# EAGLE design interface_dac_sma_feedback_2PS (EAGLE 7.2.0)
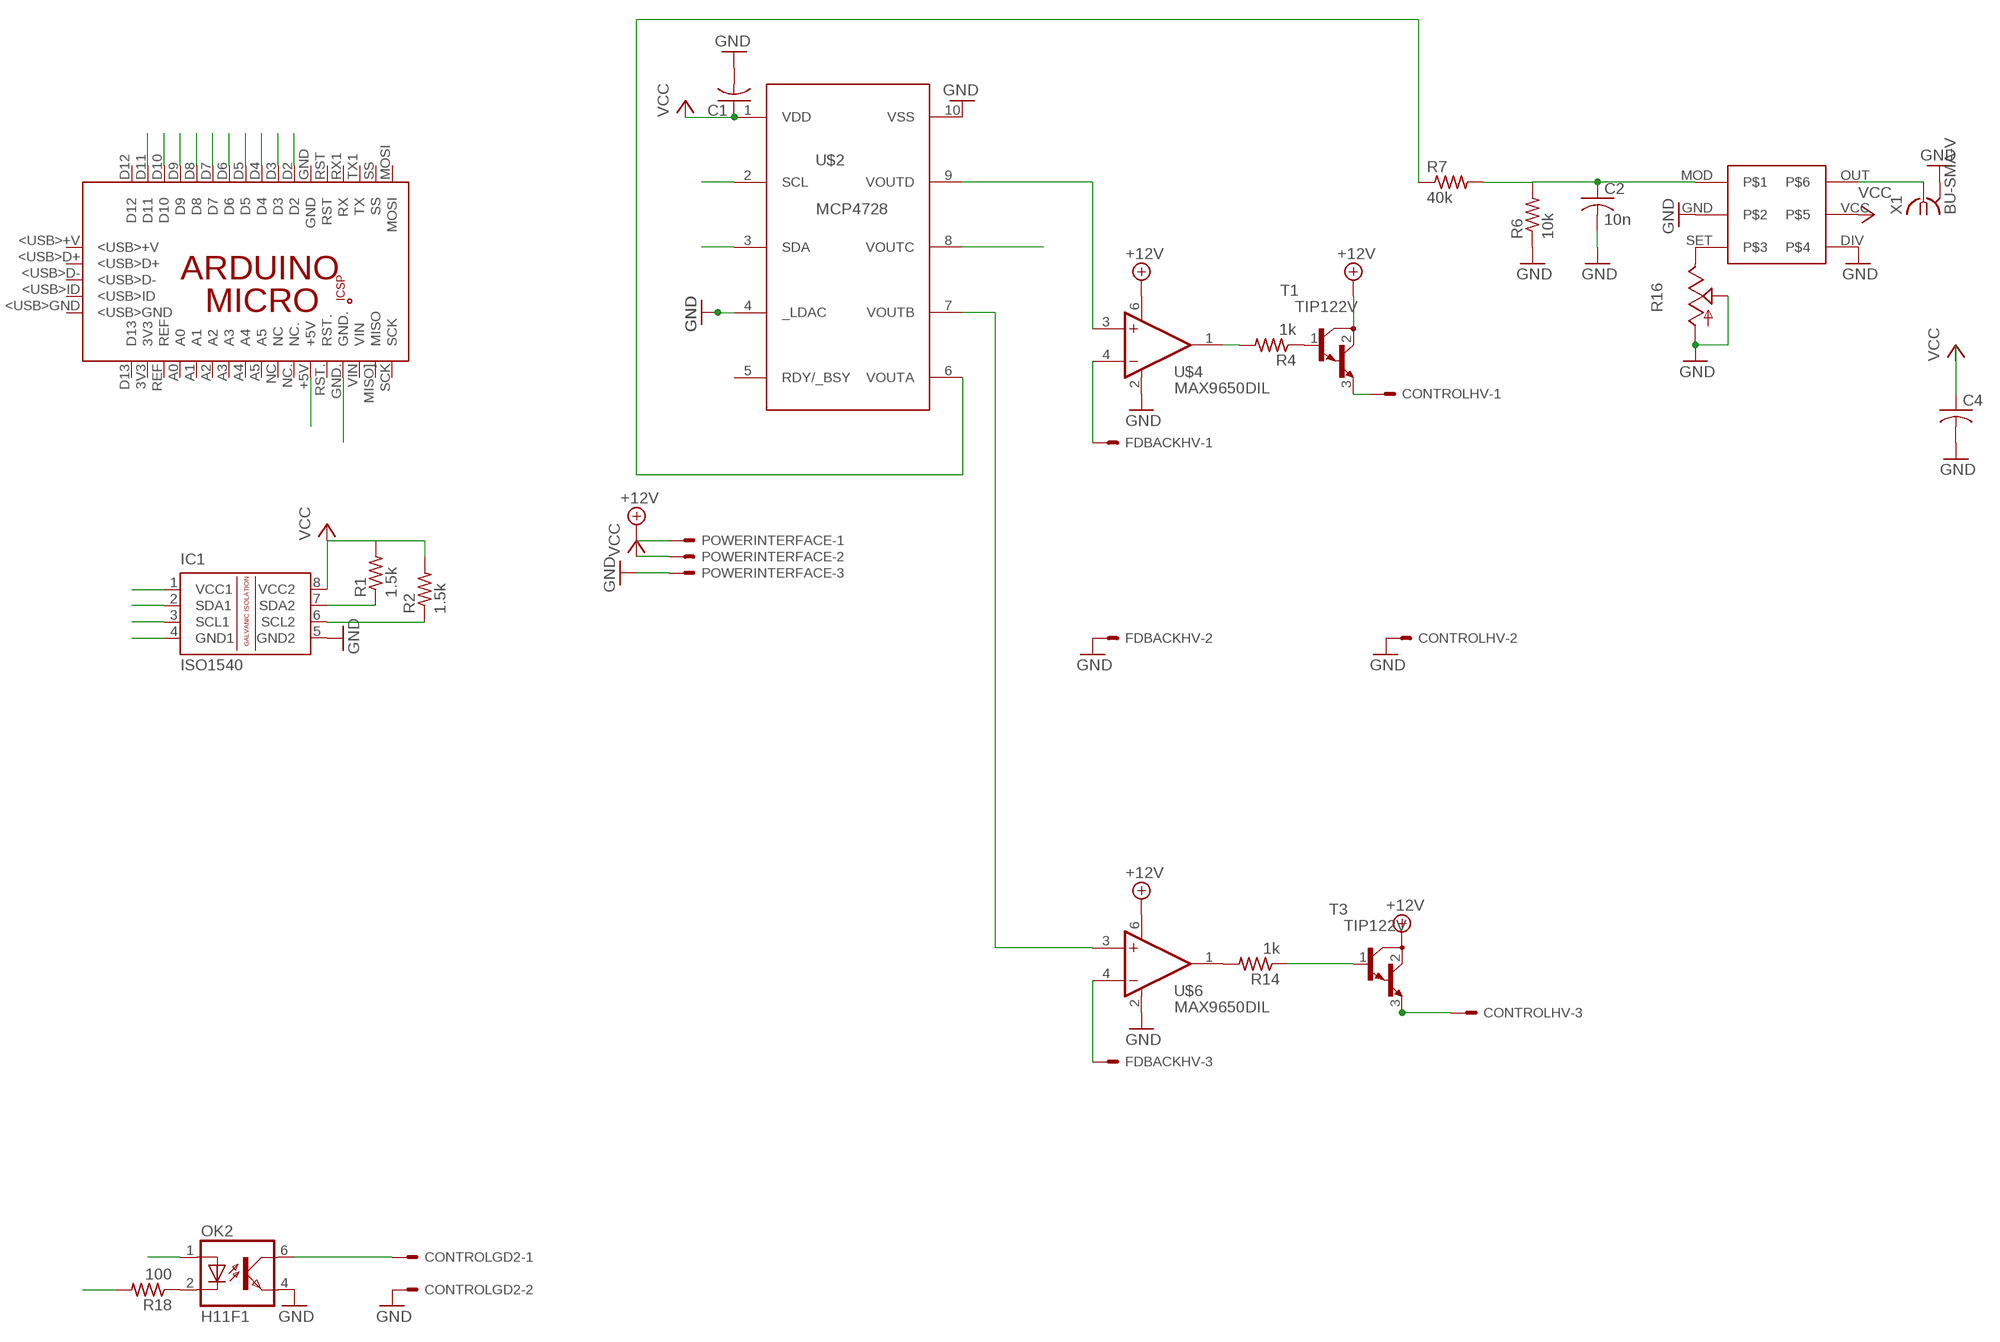
[diagram p0: schematic, sheet 1]

## Parts
C1  C-US050-050X075  [C050-050X075]
C2  10n  C-US050-024X044  [C050-024X044]
C4  C-US075-063X106  [C075-063X106]
CONTROLGD2  KK-156-2  [KK-156-2]
CONTROLHV  KK-156-3  [KK-156-3]
FDBACKHV  KK-156-3  [KK-156-3]
IC1  ISO1540  [DIL08]
OK2  H11F1  [DIL05]
PCB1  ARDUINO_MICRO  [ARDUINO_MICRO]
POWERINTERFACE  KK-156-3  [KK-156-3]
R1  1.5k  R-US_0207/12  [0207/12]
R2  1.5k  R-US_0207/12  [0207/12]
R4  1k  R-US_0207/12  [0207/12]
R6  10k  R-US_0207/12  [0207/12]
R7  40k  R-US_0207/12  [0207/12]
R14  1k  R-US_0207/12  [0207/12]
R16  TRIM_US-B90P  [SP19L]
R18  100  R-US_0207/12  [0207/12]
T1  TIP122V  [TO220V]
T3  TIP122V  [TO220V]
U$1  LTC6992  [DIL06]
U$2  MCP4728DIL  [DIL10]
U$4  MAX9650DIL  [DIL06-4]
U$6  MAX9650DIL  [DIL06-4]
X1  BU-SMA-V  [BU-SMA-V]

## Nets
+12V: POWERINTERFACE.1 T1.2(C) T3.2(C) U$4.6(V+) U$6.6(V+)
A+5: IC1.1(VCC1) PCB1.+5V
AGND: IC1.4(GND1) PCB1.GND. R18.2
D4: PCB1.D4
D7: PCB1.D7
D8: PCB1.D8
D10: PCB1.D10
D11: PCB1.D11
ENSW2: CONTROLGD2.1 OK2.6(COL)
GND: C1.2 C2.2 C4.2 CONTROLGD2.2 CONTROLHV.2 FDBACKHV.2 IC1.5(GND2) OK2.4(EMIT) POWERINTERFACE.3 R6.1 R16.A R16.S U$1.DIV U$1.GND U$2.4(_LDAC) U$2.10(VSS) U$4.2(V-) U$6.2(V-) X1.2 X1.3 X1.4 X1.5
N$1: R7.1 U$2.6(VOUTA)
N$2: C2.1 R6.2 R7.2 U$1.MOD
N$3: R4.1 T1.1(B)
N$4: CONTROLHV.1 T1.3(E)
N$5: CONTROLHV.3 T3.3(E)
N$6: OK2.2(C) R18.1
N$8: FDBACKHV.1 U$4.4(-IN)
N$12: R16.E U$1.SET
N$13: U$1.OUT X1.1
N$14: FDBACKHV.3 U$6.4(-IN)
N$15: R14.1 T3.1(B)
N$16: U$2.9(VOUTD) U$4.3(+IN)
N$17: U$2.8(VOUTC)
N$18: U$2.7(VOUTB) U$6.3(+IN)
N$19: R4.2 U$4.1(OUT)
N$21: R14.2 U$6.1(OUT)
PWM5: PCB1.D5
PWM6: PCB1.D6
PWM9: OK2.1(A) PCB1.D9
SCL: IC1.3(SCL1) PCB1.D3
SCL_OUT: IC1.6(SCL2) R2.1 U$2.2(SCL)
SDA: IC1.2(SDA1) PCB1.D2
SDA_OUT: IC1.7(SDA2) R1.1 U$2.3(SDA)
VCC: C1.1 C4.1 IC1.8(VCC2) POWERINTERFACE.2 R1.2 R2.2 U$1.VCC U$2.1(VDD)
Unconnected: PCB1.3V3 PCB1.5V PCB1.<USB>+V PCB1.<USB>D+ PCB1.<USB>D- PCB1.<USB>GND PCB1.<USB>ID PCB1.A0 PCB1.A1 PCB1.A2 PCB1.A3 PCB1.A4 PCB1.A5 PCB1.D12 PCB1.D13 PCB1.GND PCB1.GND_ PCB1.MISO. PCB1.MISO](MISO) PCB1.MOSI PCB1.MOSI. PCB1.NC PCB1.NC. PCB1.REF PCB1.RESET.. PCB1.RST PCB1.RST. PCB1.RX1(RX) PCB1.SCK PCB1.SCK. PCB1.SS PCB1.TX1(TX) PCB1.VIN U$2.5(RDY/_BSY)

## Library data of the parts
C1 = rcl:C-US: CAPACITOR, American symbol
C2 C4 = resistor:C-US: CAPACITOR, American symbol
CONTROLGD2 = con-molex:KK-156-2: KK 156 HEADER Source: http://www.molex.com/pdm_docs/sd/026604100_sd.pdf; OC_FARNELL: unknown; OC_NEWARK: unknown
CONTROLHV FDBACKHV POWERINTERFACE = con-molex:KK-156-3: KK 156 HEADER Source: http://www.molex.com/pdm_docs/sd/026604100_sd.pdf; OC_FARNELL: unknown; OC_NEWARK: unknown
IC1 = texas:ISO1540: ISOLATED CAN TRANSCEIVER Source: http://focus.ti.com/lit/ds/symlink/iso1050.pdf
OK2 = optocoupler:H11F1: OPTO COUPLER OPTO COUPLER; OC_FARNELL: unknown; OC_NEWARK: unknown
PCB1 = E14_Arduino_published:ARDUINO_MICRO: Device for representing an Arduino Micro board with a footprint in an EAGLE design. Created by Dave Young for Element14. More EAGLE documentation at: http://www.element14.com/community/community/knode/cadsoft_eagle
R1 R2 R4 R6 R7 R14 = resistor:R-US_: RESISTOR, American symbol
R16 = pot:TRIM_US-: POTENTIOMETER
R18 = rcl:R-US_: RESISTOR, American symbol
T1 T3 = transistor-npn:TIP122*: NPN Darlington Transistor
U$1 = linear-technology:LTC6992
U$2 = microchip:MCP4728
U$4 U$6 = maxim:MAX9650
X1 = con-coax:BU-SMA-V: FEMALE SMA CONNECTOR Radiall distributor RS 112-3794; OC_FARNELL: unknown; OC_NEWARK: unknown

## Board
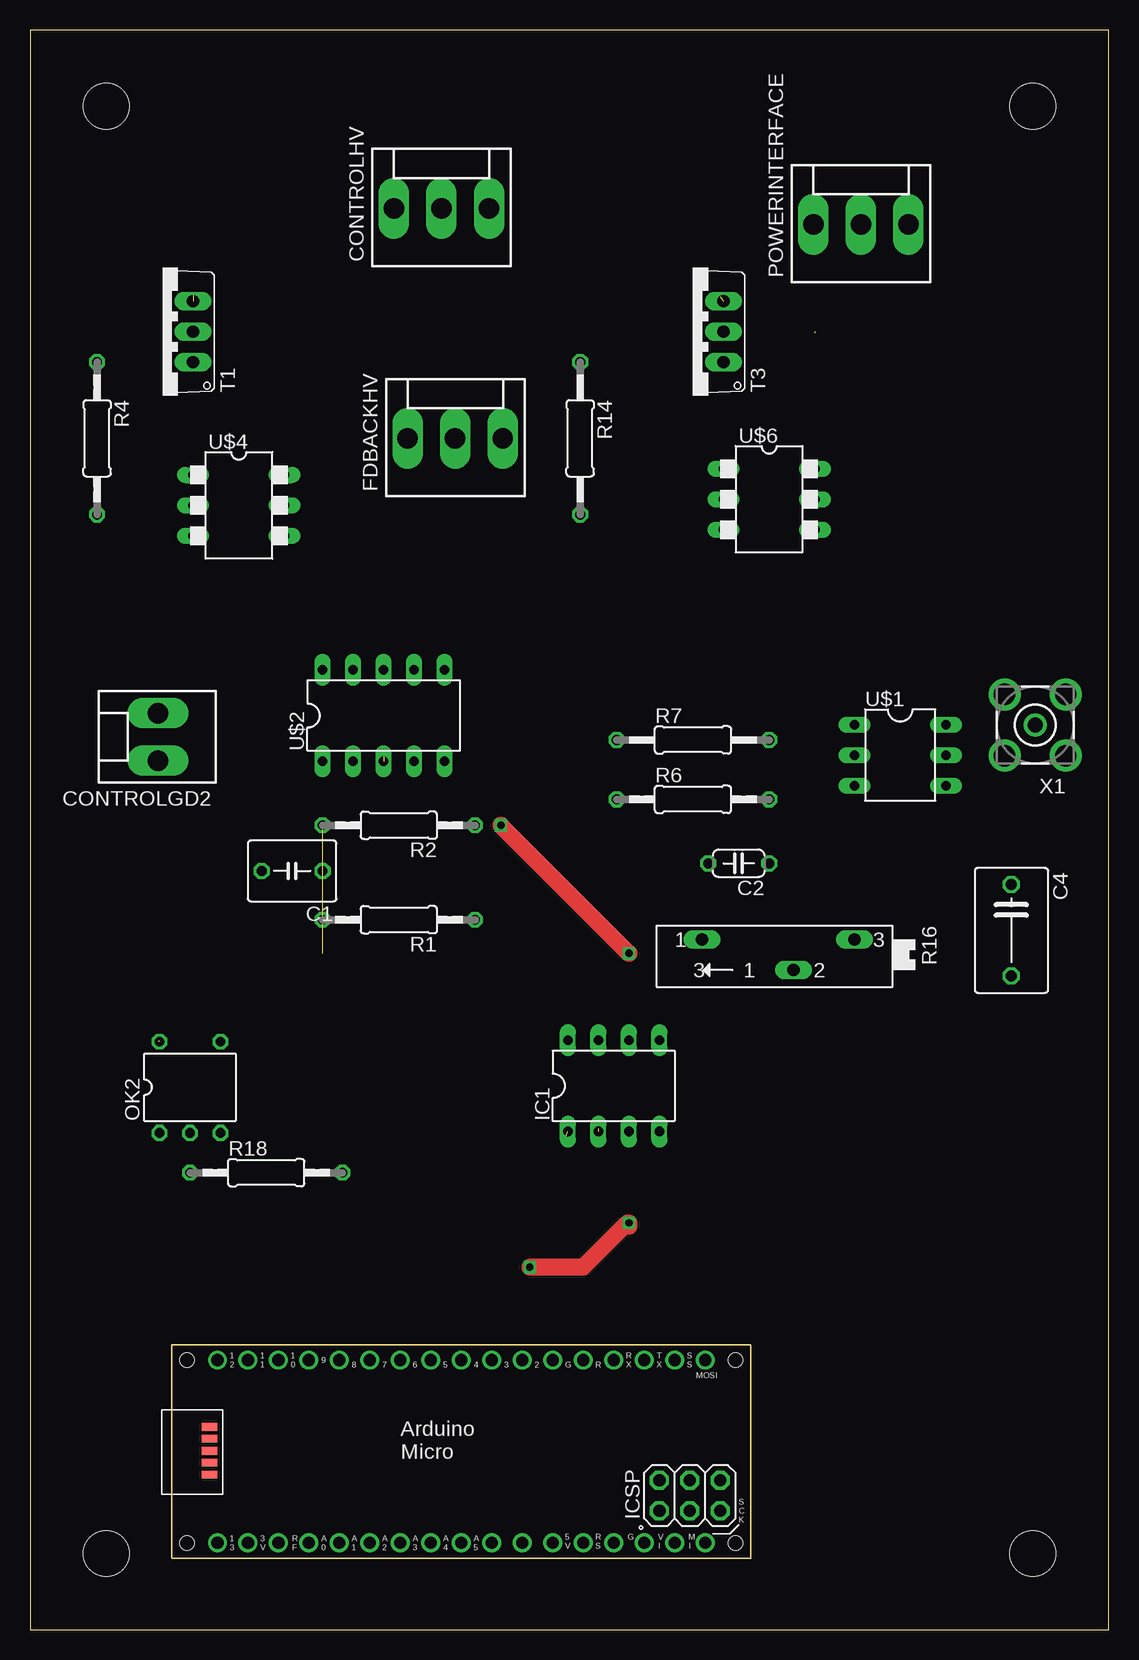
[diagram p1: board, top side]
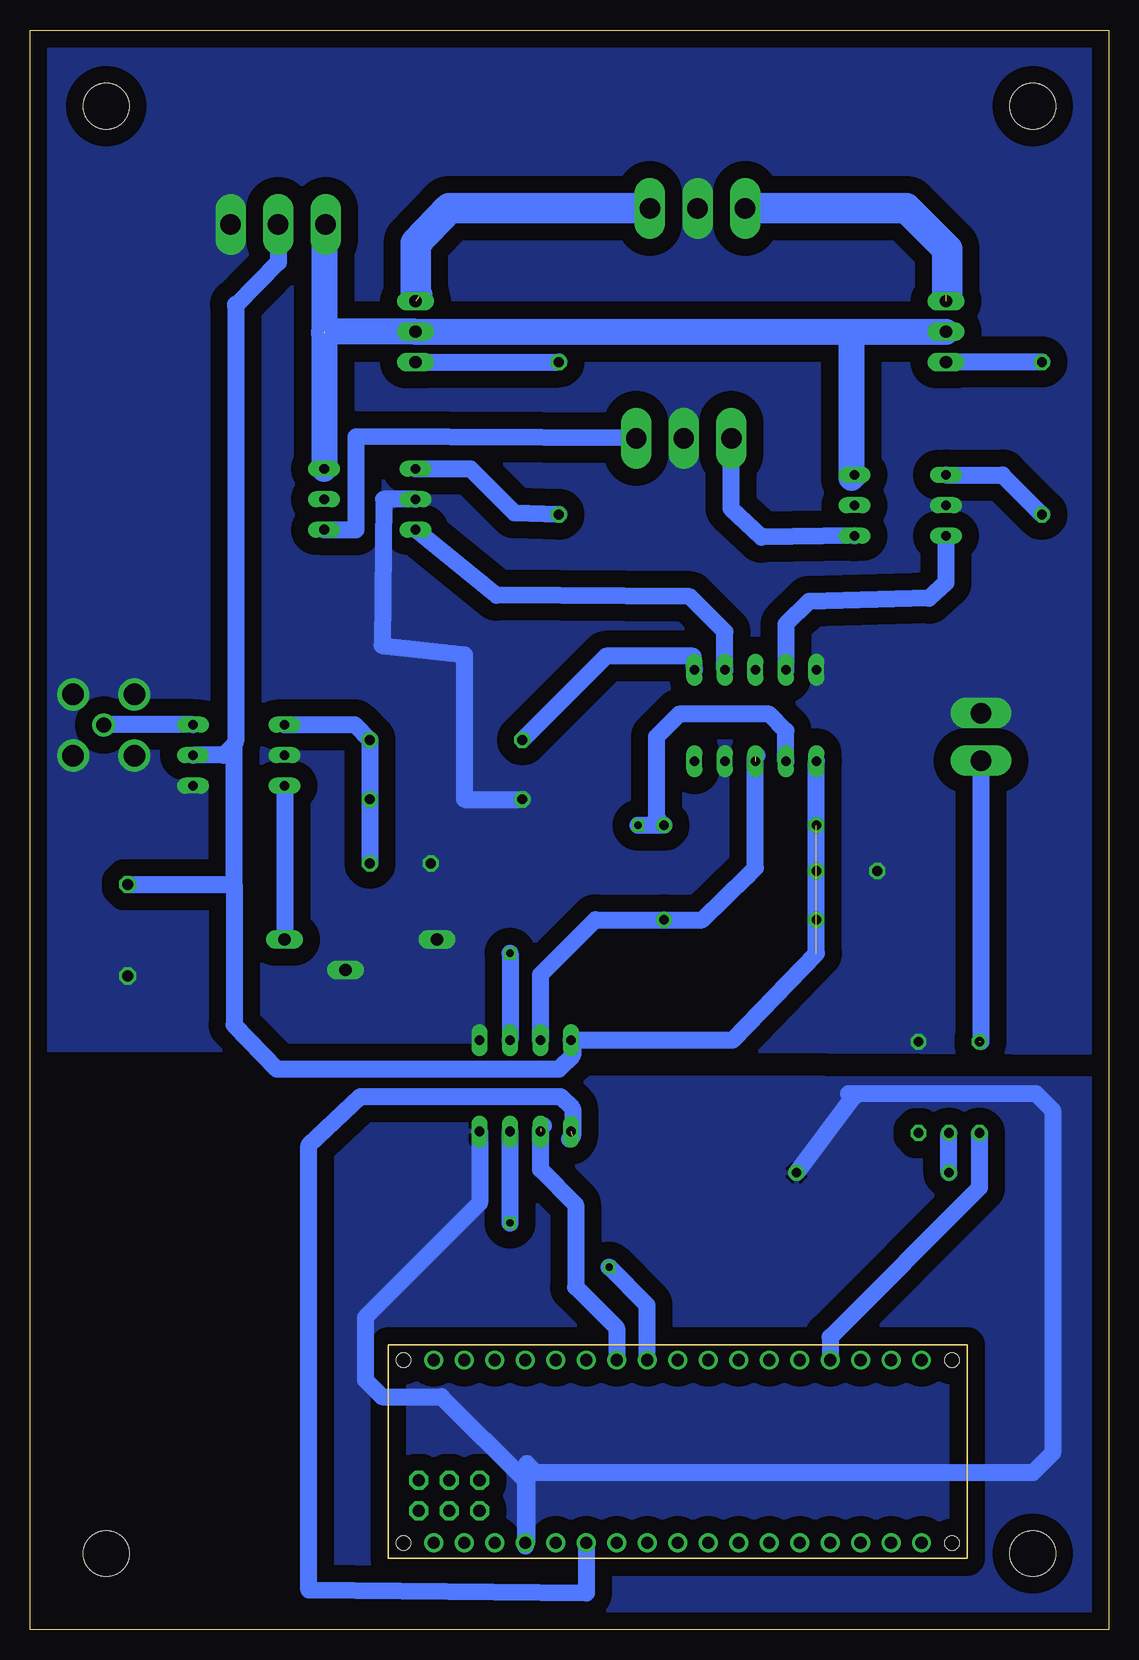
[diagram p2: board, bottom side, seen from below]

Size 89.92 x 133.35 mm. Coordinates in mm from the lower left corner, seen from the top.
Outline: 0,0 89.92,0 89.92,133.35 0,133.35 0,0
Copper layers (1*16): Top 0.035mm / dielectric 1.5mm / Bottom 0.035mm
Design rules "default": minimum track width 10mil, minimum drill 24mil, track to track 8mil, track to pad 8mil, pad to pad 8mil, via to via 8mil, smd to smd 8mil, copper to edge 40mil, drill to drill 8mil, minimum pad ring 10mil, minimum via ring 8mil, stop-mask expansion 4mil, vias tented up to drill 0mil, thermal gap 10mil
Holes 3.8 mm at 83.57,6.35 83.57,127 6.35,127 6.35,6.35

### Footprints (pad centres in the part's own frame; a part is rotated, then mirrored left to right if it is on the bottom)
C050-050X075 = drill 0.813 octagon: 1 -2.54,0; 2 2.54,0
C050-024X044 = drill 0.813 octagon: 1 -2.54,0; 2 2.54,0
C075-063X106 = drill 0.914 octagon: 1 -3.81,0; 2 3.81,0
KK-156-2 = drill 1.7 pad 2.184 long: 1 -1.98,0; 2 1.98,0
KK-156-3 = drill 1.7 pad 2.184 long: 1 -3.96,0; 2 0,0; 3 3.96,0
DIL08 = drill 0.813 long: 1 -3.81,-3.81; 2 -1.27,-3.81; 3 1.27,-3.81; 4 3.81,-3.81; 5 3.81,3.81; 6 1.27,3.81; 7 -1.27,3.81; 8 -3.81,3.81
DIL05 = drill 0.813 octagon: 1 -2.54,-3.81; 2 0,-3.81; 3 2.54,-3.81; 4 2.54,3.81; 6 -2.54,3.81
ARDUINO_MICRO = drill 1.016 pad 1.575: 3V3 6.35,1.27; +5V 31.75,1.27; A0 11.43,1.27; A1 13.97,1.27; A2 16.51,1.27; A3 19.05,1.27; A4 21.59,1.27; A5 24.13,1.27; D2 29.21,16.51; D3 26.67,16.51; D4 24.13,16.51; D5 21.59,16.51; D6 19.05,16.51; D7 16.51,16.51; D8 13.97,16.51; D9 11.43,16.51; D10 8.89,16.51; D11 6.35,16.51; D12 3.81,16.51; D13 3.81,1.27; GND 31.75,16.51; GND. 36.83,1.27; MISO] 41.91,1.27; MOSI 44.45,16.51; NC 26.67,1.27; NC. 29.21,1.27; REF 8.89,1.27; RST 34.29,16.51; RST. 34.29,1.27; RX1 36.83,16.51; SCK 44.45,1.27; SS 41.91,16.51; TX1 39.37,16.51; VIN 39.37,1.27 | drill 1.016 pad 1.575 octagon: 5V 40.64,6.477; GND_ 45.72,6.477; MISO. 40.64,3.937; MOSI. 43.18,6.477; RESET.. 45.72,3.937; SCK. 43.18,3.937 | smd 1.27 x 0.635: <USB>+V 3.15,10.947; <USB>D+ 3.15,9.957; <USB>D- 3.15,8.941; <USB>GND 3.15,6.96; <USB>ID 3.15,7.976 | hole 1.2: 1.27,1.27; 1.27,16.51; 46.99,16.51; 46.99,1.27
0207/12 = drill 0.813 octagon: 1 -6.35,0; 2 6.35,0
SP19L = drill 1.016 long: A 5.715,-1.27; E -6.985,-1.27; S -1.905,1.27
TO220V = drill 1.016 long: 1 -2.54,-2.54; 2 0,-2.54; 3 2.54,-2.54
DIL06 = drill 0.813 long: DIV 2.54,3.81; GND 0,-3.81; MOD -2.54,-3.81; OUT -2.54,3.81; SET 2.54,-3.81; VCC 0,3.81
DIL10 = drill 0.813 long: 1 -5.08,-3.81; 2 -2.54,-3.81; 3 0,-3.81; 4 2.54,-3.81; 5 5.08,-3.81; 6 5.08,3.81; 7 2.54,3.81; 8 0,3.81; 9 -2.54,3.81; 10 -5.08,3.81
DIL06-4 = drill 0.813 long: 1 -2.54,-3.81; 2 0,-3.81; 3 2.54,-3.81; 4 2.54,3.81; 5 0,3.81; 6 -2.54,3.81
BU-SMA-V = drill 1.27: 1 0,0 | drill 1.778: 2 -2.55,2.55; 3 2.55,2.55; 4 2.55,-2.55; 5 -2.55,-2.55

### Placement (x,y rotation side)
C1  21.84,63.25 180 top
C2  59.05,63.88 180 top
C4  81.79,58.29 270 top
CONTROLGD2  10.67,74.42 90 top
CONTROLHV  34.29,118.49 0 top
FDBACKHV  35.43,99.31 0 top
IC1  48.64,45.34 0 top
OK2  13.34,45.21 0 top
PCB1  11.81,5.97 0 top
POWERINTERFACE  69.24,117.14 0 top
R1  30.73,59.18 180 top
R2  30.73,67.06 180 top
R4  5.59,99.31 270 top
R6  55.24,69.22 0 top
R7  55.24,74.17 0 top
R14  45.85,99.31 270 top
R16  61.72,56.26 180 top
R18  19.68,38.1 0 top
T1  11.05,108.2 90 top
T3  55.24,108.2 90 top
U$1  72.52,72.9 270 top
U$2  29.46,76.2 0 top
U$4  17.4,93.73 270 top
U$6  61.59,94.23 270 top
X1  83.77,75.41 180 top

### Tracks (layer width: path | path; a pad name or v marks a point on that pad's centre or on a via)
+12V  (1 unrouted)
  Bottom 2.184: U$4.6 21.46,96.01 21.46,108.2 | 21.46,108.2 T3.2 65.41,108.2 | 21.46,108.2 T1.2 | POWERINTERFACE.1 65.41,117.02 65.41,108.08 U$6.6
A+5  (1 unrouted)
  Bottom 1.422: PCB1.+5V 43.56,3.05 66.67,3.3 66.67,40.39 62.36,44.45 45.72,44.45 44.7,43.43 44.7,41.15 44.96,40.89
AGND
  Bottom 1.422: IC1.4 52.45,35.56 61.98,26.04 61.98,20.83 60.58,19.43 55.63,19.43 48.64,12.45 PCB1.GND. | PCB1.GND. 48.64,6.99 | R18.2 21.34,44.32 21.72,44.7 6.1,44.7 4.7,43.31 4.7,14.73 6.35,13.08 47.75,13.08 48.51,13.84 48.51,7.37 PCB1.GND.
  pour Bottom (isolate 1.422): -0.13,0.13 94.23,0.13 94.36,46.1 0.13,45.97
ENSW2  (1 unrouted)
  Bottom 1.422: CONTROLGD2.1 10.67,49.02
GND
  Bottom 1.422: U$6.2 60.45,94.23 60.58,82.04 53.72,81.28 53.72,69.22 R6.1
  pour Bottom (isolate 1.422, no thermals): 0.13,133.22 90.04,133.22 89.92,48.39 69.34,48.39 69.6,48.51 0.38,48.13
N$1
  Bottom 1.422: U$2.6 34.67,81.15 41.91,81.15 R7.1
N$2
  Bottom 1.422: U$1.MOD 62.87,75.44 R7.2 R6.2 C2.1
N$3
  Bottom 1.422: R4.1 T1.1
N$4  (1 unrouted)
  Bottom 2.184: 13.46,111.38 13.59,111.25
  Bottom 2.54: CONTROLHV.1 16.89,118.49 13.46,115.06 13.46,111.38
N$5  (1 unrouted)
  Bottom 2.184: 57.66,111.25 57.53,111.12
  Bottom 2.54: CONTROLHV.3 54.99,118.49 57.78,115.57 57.78,111.38 57.66,111.25
N$6
  Bottom 1.422: R18.1 OK2.2
N$8
  Bottom 1.422: U$4.4 28.96,91.06 31.5,93.47 31.5,98.96 FDBACKHV.1
N$12
  Bottom 1.422: U$1.SET R16.E
N$13
  Bottom 1.422: U$1.OUT 83.49,75.44 X1.1
N$14
  Bottom 1.422: U$6.4 62.74,91.69 62.74,99.44 FDBACKHV.3
N$15
  Bottom 1.422: T3.1 R14.1
N$16
  Bottom 1.422: U$4.3 13.59,87.25 14.99,85.98 25.02,85.72 26.92,83.82 U$2.9
N$18
  Bottom 1.422: U$2.7 32,83.19 34.92,86.11 51.05,86.23 U$6.3
N$19
  Bottom 1.422: U$4.1 8.89,96.27 R4.2
N$21
  Bottom 1.422: U$6.1 53.21,96.77 49.53,93.09 R14.2
PWM9
  Bottom 1.422: PCB1.D9 23.24,24.38 10.79,36.83 OK2.1
SCL  (via drill 0.6)
  Top 1.422: v41.66,30.23 46.1,30.23 49.78,33.91 49.91,33.66 v49.91,33.91
  Bottom 1.422: PCB1.D3 38.48,27.05 v41.66,30.23 | v49.91,33.91 IC1.3
SCL_OUT  (via drill 0.6)
  Top 1.422: v39.24,67.06 v49.91,56.39
  Bottom 1.422: U$2.2 26.92,74.93 28.32,76.33 35.81,76.33 37.72,74.42 37.72,67.69 R2.1 v39.24,67.06 | v49.91,56.39 IC1.6
SDA  (1 unrouted)
  Bottom 1.422: 47.12,42.04 47.37,41.78 47.37,38.35 44.45,35.43 44.45,28.57 41.02,25.15 PCB1.D2
SDA_OUT  (1 unrouted)
  Bottom 1.422: IC1.7 47.37,54.61 42.8,59.18 R1.1 33.91,59.18 30.1,62.87 29.46,63.5 29.46,72.77 29.34,72.9
VCC  (3 unrouted)
  Bottom 1.422: 72.9,73.79 72.77,74.04 72.77,110.36 | 72.9,73.79 73.79,72.9 U$1.VCC | C4.1 72.9,62.1 | 72.9,62.1 72.9,73.79 | U$2.1 24.38,56.39 31.37,49.15 IC1.8 44.7,49.02 44.7,47.88 45.85,46.74 69.34,46.74 72.9,50.42 72.9,62.1 | POWERINTERFACE.2 69.22,114 72.77,110.36 | 72.77,110.49 72.77,110.36